# Altium schematic sheet JTAG_ALTIUM_HOST.SchDoc: Host JTAG Header
size A4; Organization: Altium Limited.; Address1: Level 3, 12a Rodborough Rd; Address2: Frenchs Forest 2086; Address3: NSW; Address4: AUSTRALIA; SheetNumber: 1; SheetTotal: 100
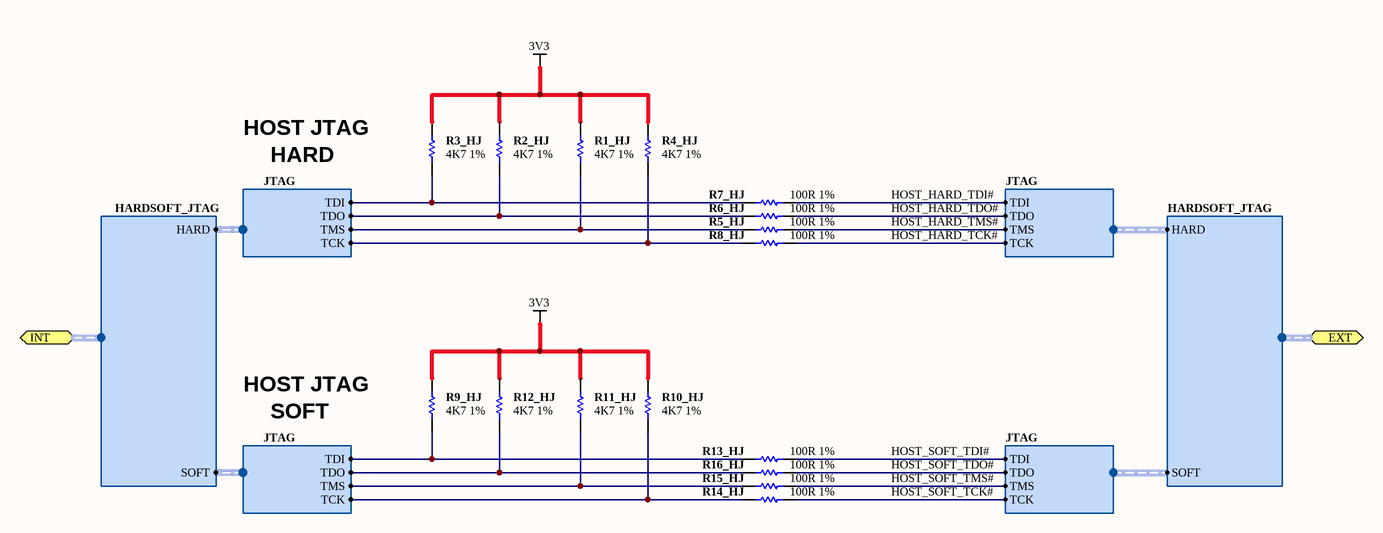
[diagram p0: JTAG_ALTIUM_HOST.SchDoc]

## Parts
R1_HJ  4K7 1%  [RESC1005-STAR]
R2_HJ  4K7 1%  [RESC1005-STAR]
R3_HJ  4K7 1%  [RESC1005-STAR]
R4_HJ  4K7 1%  [RESC1005-STAR]
R5_HJ  100R 1%  [RESC1005-STAR]
R6_HJ  100R 1%  [RESC1005-STAR]
R7_HJ  100R 1%  [RESC1005-STAR]
R8_HJ  100R 1%  [RESC1005-STAR]
R9_HJ  4K7 1%  [RESC1005-STAR]
R10_HJ  4K7 1%  [RESC1005-STAR]
R11_HJ  4K7 1%  [RESC1005-STAR]
R12_HJ  4K7 1%  [RESC1005-STAR]
R13_HJ  100R 1%  [RESC1005-STAR]
R14_HJ  100R 1%  [RESC1005-STAR]
R15_HJ  100R 1%  [RESC1005-STAR]
R16_HJ  100R 1%  [RESC1005-STAR]

## Ports
EXT (harness HARDSOFT_JTAG), INT (harness HARDSOFT_JTAG)

## Harnesses
HARDSOFT_JTAG: HARD, SOFT
JTAG: TMS, TDO, TDI, TCK

## Nets
3V3: R1_HJ.2 R2_HJ.2 R3_HJ.2 R4_HJ.2 R9_HJ.2 R10_HJ.2 R11_HJ.2 R12_HJ.2
HOST_HARD_TCK#: R8_HJ.2 ; harness JTAG.TCK
HOST_HARD_TDI#: R7_HJ.2 ; harness JTAG.TDI
HOST_HARD_TDO#: R6_HJ.2 ; harness JTAG.TDO
HOST_HARD_TMS#: R5_HJ.2 ; harness JTAG.TMS
HOST_SOFT_TCK#: R14_HJ.2 ; harness JTAG.TCK
HOST_SOFT_TDI#: R13_HJ.2 ; harness JTAG.TDI
HOST_SOFT_TDO#: R16_HJ.2 ; harness JTAG.TDO
HOST_SOFT_TMS#: R15_HJ.2 ; harness JTAG.TMS
NetR1_HJ_1: R1_HJ.1 R5_HJ.1 ; harness JTAG.TMS
NetR2_HJ_1: R2_HJ.1 R6_HJ.1 ; harness JTAG.TDO
NetR3_HJ_1: R3_HJ.1 R7_HJ.1 ; harness JTAG.TDI
NetR4_HJ_1: R4_HJ.1 R8_HJ.1 ; harness JTAG.TCK
NetR9_HJ_1: R9_HJ.1 R13_HJ.1 ; harness JTAG.TDI
NetR10_HJ_1: R10_HJ.1 R14_HJ.1 ; harness JTAG.TCK
NetR11_HJ_1: R11_HJ.1 R15_HJ.1 ; harness JTAG.TMS
NetR12_HJ_1: R12_HJ.1 R16_HJ.1 ; harness JTAG.TDO

## Notes on the sheet
- HOST JTAG
- HARD
- SOFT
- Sheet Title
- Project Title
- Size:
- Date:
- A4
- Assy:
- Time:
- Revision:
- Sheet
- of
- File:

## Library data of the parts
R1_HJ R2_HJ R3_HJ R4_HJ R9_HJ R10_HJ R11_HJ R12_HJ = D-100-0088: Resistor, 4K7 1% 0402 (1005); Power Rating: 63 mW; Resistance: 4.7 K; Category: Resistor; Mounting Technology: Surface Mount; Status: Production; Tolerance: 1 %
R5_HJ R6_HJ R7_HJ R8_HJ R13_HJ R14_HJ R15_HJ R16_HJ = D-100-0131: Resistor, 100R 1% 0402 (1005); Power Rating: 63 mW; Category: Resistor; Mounting Technology: Surface Mount; Resistance: 100 R; Status: Production; Tolerance: 1 %